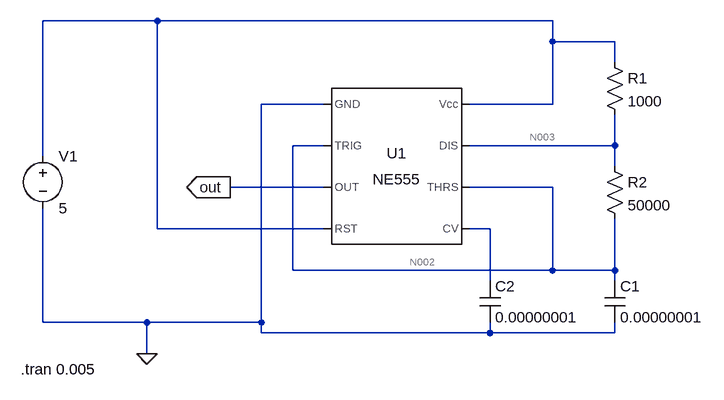
[diagram p0: schematic Draft.asc]
Draft.asc, the LTspice schematic file:
Version 4
SHEET 1 880 680
WIRE -144 -48 -320 -48
WIRE 464 -48 -144 -48
WIRE 464 -16 464 -48
WIRE 560 -16 464 -16
WIRE 560 16 560 -16
WIRE 112 80 16 80
WIRE 464 80 464 -16
WIRE 464 80 336 80
WIRE 112 144 64 144
WIRE 560 144 560 96
WIRE 560 144 336 144
WIRE -320 160 -320 -48
WIRE 560 176 560 144
WIRE 112 208 -32 208
WIRE 464 208 336 208
WIRE -144 272 -144 -48
WIRE 112 272 -144 272
WIRE 368 272 336 272
WIRE 64 336 64 144
WIRE 464 336 464 208
WIRE 464 336 64 336
WIRE 560 336 560 256
WIRE 560 336 464 336
WIRE 368 352 368 272
WIRE 560 352 560 336
WIRE -320 416 -320 240
WIRE -160 416 -320 416
WIRE 16 416 16 80
WIRE 16 416 -160 416
WIRE 16 432 16 416
WIRE 368 432 368 416
WIRE 368 432 16 432
WIRE 560 432 560 416
WIRE 560 432 368 432
WIRE -160 464 -160 416
FLAG -160 464 0
FLAG -32 208 out
IOPIN -32 208 Out
SYMBOL Misc\\NE555 224 176 R0
SYMATTR InstName U1
SYMBOL voltage -320 144 R0
WINDOW 123 0 0 Left 0
WINDOW 39 0 0 Left 0
SYMATTR InstName V1
SYMATTR Value 5
SYMBOL res 544 0 R0
SYMATTR InstName R1
SYMATTR Value 1000
SYMBOL res 544 160 R0
SYMATTR InstName R2
SYMATTR Value 50000
SYMBOL cap 544 352 R0
SYMATTR InstName C1
SYMATTR Value 0.00000001
SYMBOL cap 352 352 R0
SYMATTR InstName C2
SYMATTR Value 0.00000001
TEXT -354 488 Left 2 !.tran 0.005

The netlist it stands for:
* Draft.asc
XU1 0 N002 out N001 N004 N002 N003 N001 NE555  ; pins GND TRIG OUT RST CV THRS DIS Vcc
V1 N001 0 5
R1 N001 N003 1000
R2 N003 N002 50000
C1 N002 0 0.00000001
C2 N004 0 0.00000001
.tran 0.005
.lib NE555.sub
.backanno
.end

* Results of the author's LTspice run, read from the files saved beside the schematic
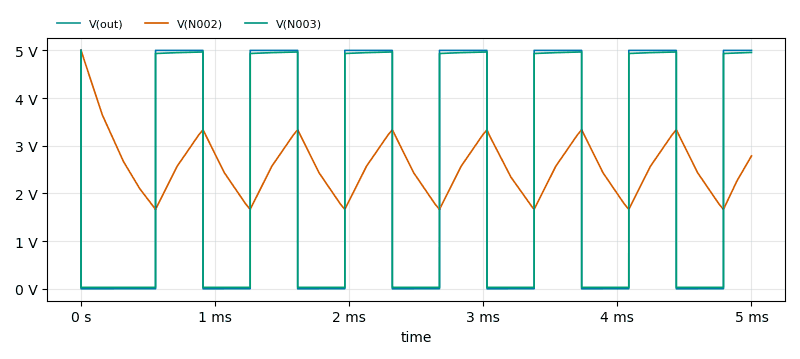
[diagram p1: Transient Analysis of Draft.asc, plotted from the saved traces]
* Transient Analysis, 1 run:
*   V(out): min 30 µV, max 5 V, average 2.334 V, rms 3.416 V, last 5 V
*   V(N002): min 1.665 V, max 4.999 V, average 2.551 V, rms 2.636 V, last 2.786 V
*   V(N003): min 30.02 mV, max 5 V, average 2.328 V, rms 3.383 V, last 4.957 V